# Altium schematic sheet PSU.SchDoc
size A4
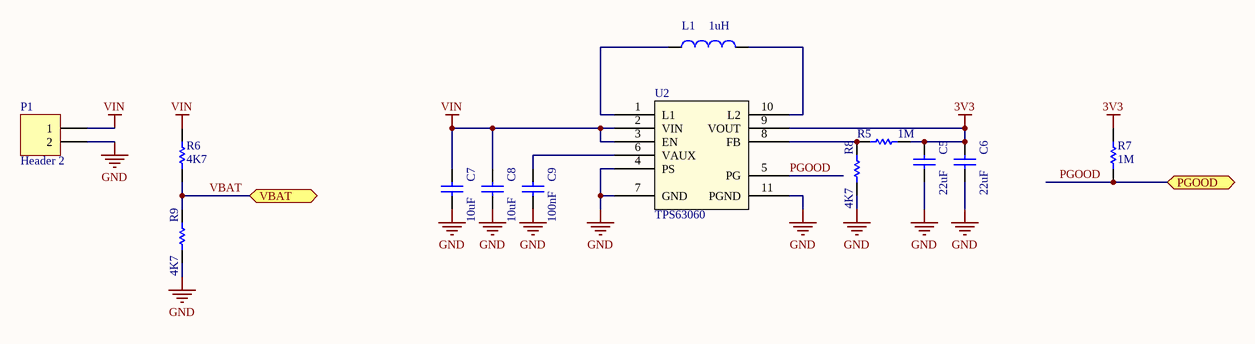
[diagram p0: PSU.SchDoc]

## Parts
C5  value 22uF  [CAPC2512L]  (hidden comment: CAP0603-)
C6  value 22uF  [CAPC2512L]  (hidden comment: CAP0603-)
C7  value 10uF  [CAPC2512L]  (hidden comment: CAP0603-)
C8  value 10uF  [CAPC2512L]  (hidden comment: CAP0603-)
C9  value 100nF  [RESC2012L]  (hidden comment: CAP0603-)
L1  value 1uH  [INDC3225M]  (hidden comment: ?)
P1  Header 2  [HDR1X2]
R5  value 1M  [RESC2012L]  (hidden comment: RES0603-)
R6  value 4K7  [RESC2012L]  (hidden comment: RES0603-)
R7  value 1M  [RESC2012L]  (hidden comment: RES0603-)
R8  value 4K7  [RESC2012L]  (hidden comment: RES0603-)
R9  value 4K7  [RESC2012L]  (hidden comment: RES0603-)
U2  TPS63060  [SON50P300X300X100-11V]

## Ports
PGOOD, VBAT

## Nets
3V3: C5.2 C6.2 R5.1 R7.1 U2.9(VOUT)
GND: C5.1 C6.1 C7.1 C8.1 C9.1 P1.2 R8.1 R9.1 U2.4(PS) U2.7(GND) U2.11(PGND)
VIN: C7.2 C8.2 P1.1 R6.1 U2.2(VIN) U2.3(EN)
PGOOD: R7.2 U2.5(PG) ; port PGOOD
VBAT: R6.2 R9.2 ; port VBAT
NetC9_2: C9.2 U2.6(VAUX)
NetL1_1: L1.1 U2.1(L1)
NetL1_2: L1.2 U2.10(L2)
NetR5_2: R5.2 R8.2 U2.8(FB)

## Library data of the parts
C5-C9 = Cap Semi: Capacitor (Semiconductor SIM Model); Published: 8-Jun-2000; LatestRevisionDate: 29-May-2009; LatestRevisionNote: IPC-7351 Footprint Added.; PackageReference: C1206; Publisher: Altium Limited; PackageDescription: Chip Capacitor
L1 = Inductor: Code_IEC: 1005; Published: 8-Jun-2000; LatestRevisionDate: 29-May-2009; LatestRevisionNote: IPC-7351 Footprint Added.; PackageReference: 0402-A; Publisher: Altium Limited; PackageDescription: Chip Inductor; Code_JEITA: 0402
P1 = Header 2: Header, 2-Pin; LatestRevisionDate: 17-Jul-2002; LatestRevisionNote: Re-released for DXP Platform.; Publisher: Altium Limited
R5-R9 = Res Semi: Semiconductor Resistor; Published: 8-Jun-2000; LatestRevisionDate: 17-Jul-2002; LatestRevisionNote: Re-released for DXP Platform.; PackageReference: AXIAL-0.5; Publisher: Altium Limited
U2 = TPS63060: Buck-Boost Regulator